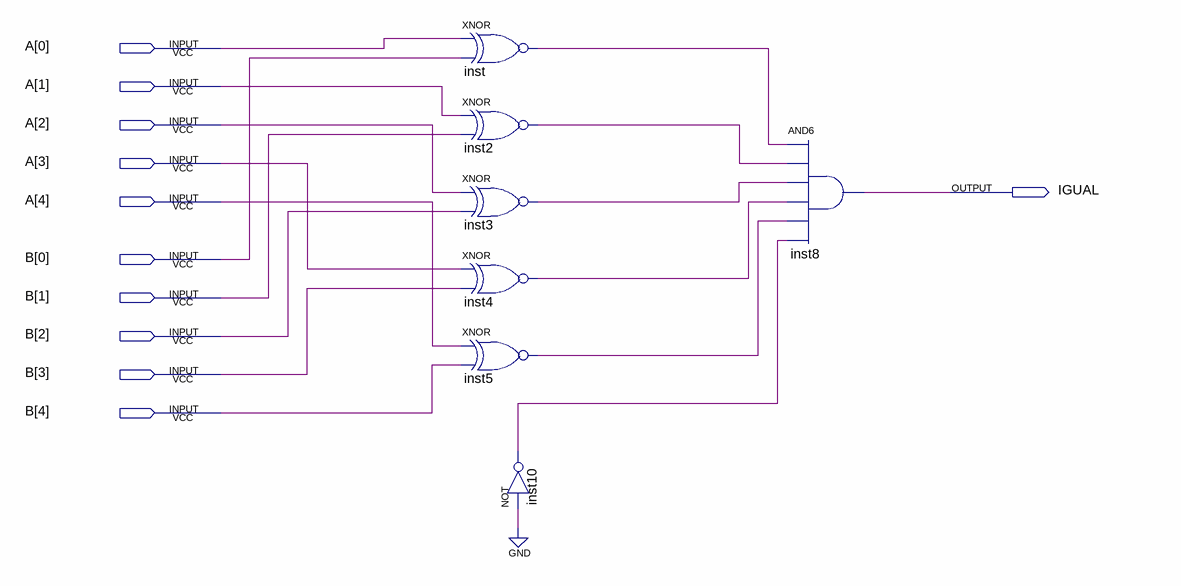
[diagram p0: schematic sheet]
// Quartus schematic IGUAL.bdf as structural Verilog: 7 symbols, 11 pins
module IGUAL (
  input  [4:0] A,
  input  [4:0] B,
  output IGUAL
);

  wire inst2_out, inst3_out, inst4_out, inst5_out, inst10_out, inst_out;

  xnor inst (inst_out, A[0], B[0]);
  xnor inst2 (inst2_out, A[1], B[1]);
  xnor inst3 (inst3_out, A[2], B[2]);
  xnor inst4 (inst4_out, A[3], B[3]);
  xnor inst5 (inst5_out, A[4], B[4]);
  not inst10 (inst10_out, 1'b0);
  and inst8 (IGUAL, inst_out, inst2_out, inst3_out, inst4_out, inst5_out, inst10_out);
endmodule
